# Altium project LED_Panel.PrjPCB (part 1 of 2)
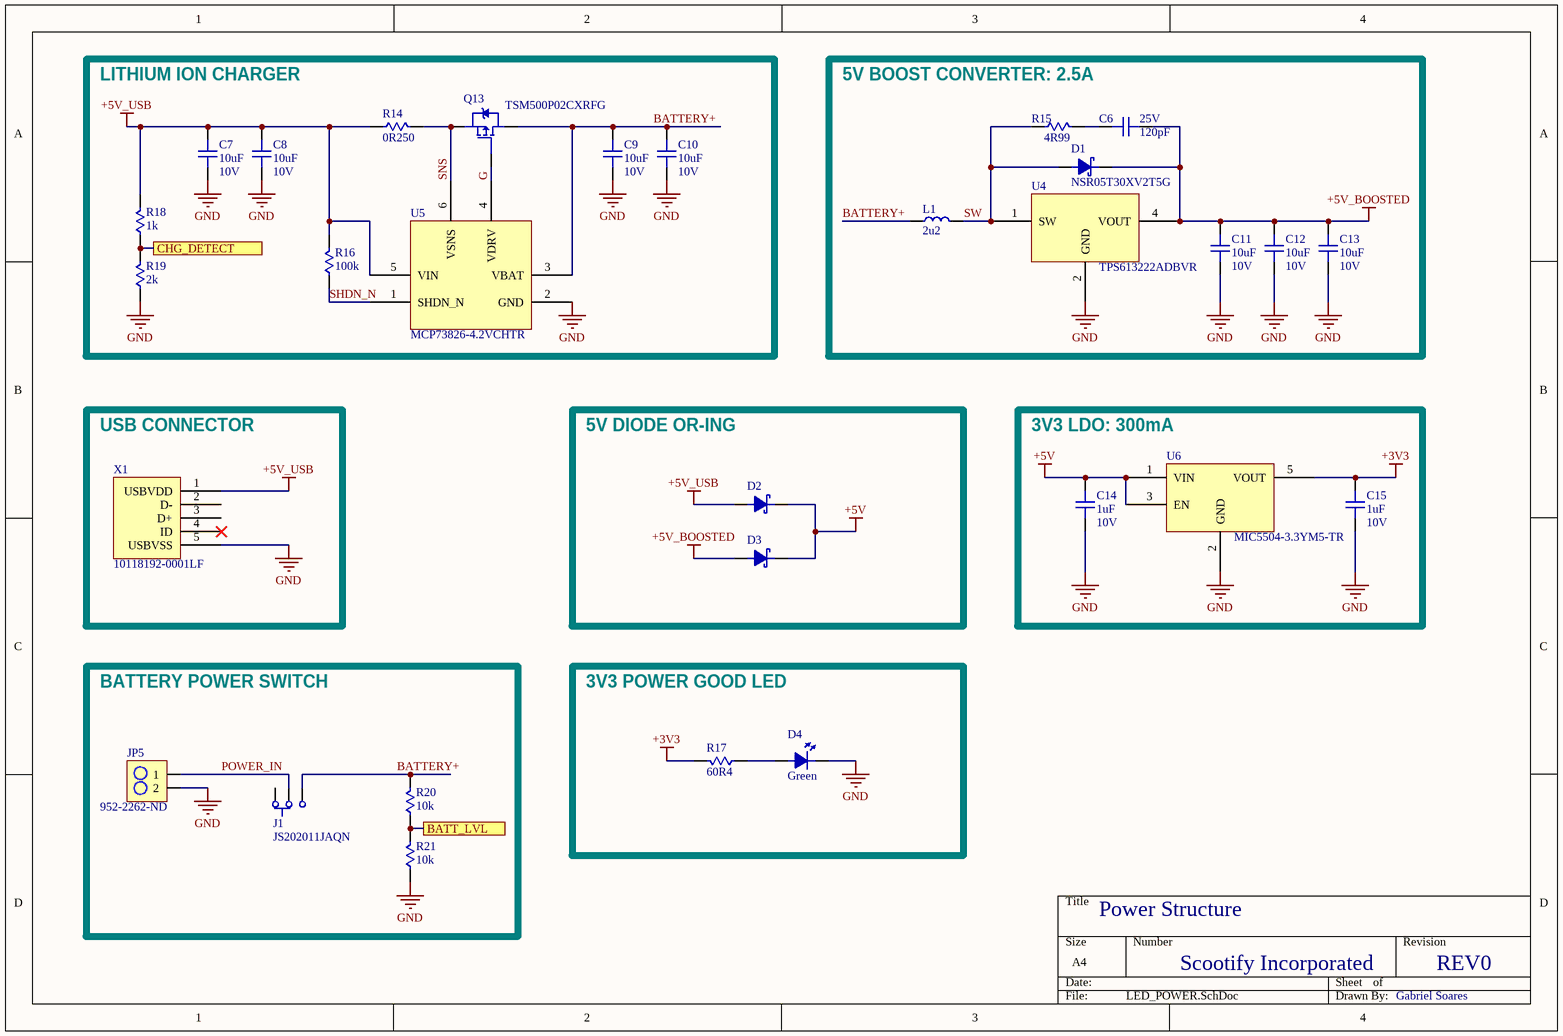
[diagram p0: LED_POWER.SchDoc]
3 sheets, 164 parts. Net scope: flat (ports and power ports of the same name join across sheets).
Board file: LED_BOARD.PcbDoc
Sheets:
  LED_POWER.SchDoc
  LED_MCU.SchDoc
  LEDs.SchDoc

## Sheet LED_POWER.SchDoc: Power Structure
size A4; CompanyName: Scootify Incorporated; DrawnBy: Gabriel Soares; Revision: REV0

### Parts
C6  120pF  Voltage Rating: 25V  [C0402]
C7  10uF  Voltage Rating (DC): 10V  [C0603]
C8  10uF  Voltage Rating (DC): 10V  [C0603]
C9  10uF  Voltage Rating (DC): 10V  [C0603]
C10  10uF  Voltage Rating (DC): 10V  [C0603]
C11  10uF  Voltage Rating (DC): 10V  [C0603]
C12  10uF  Voltage Rating (DC): 10V  [C0603]
C13  10uF  Voltage Rating (DC): 10V  [C0603]
C14  1uF  Voltage Rating: 10V  [C0402]
C15  1uF  Voltage Rating: 10V  [C0402]
D1  NSR05T30XV2T5G  [SOD-523]
D2  RB511SM-30FHT2R  [SOD-523]  (value not drawn)
D3  RB511SM-30FHT2R  [SOD-523]  (value not drawn)
D4  Green  [LED_0603]
J1  JS202011JAQN  [SWITCH]
JP5  952-2262-ND  [2PIN_HEADER]
L1  2u2  [INDUCTOR]
Q13  TSM500P02CXRFG  [SOT23-3_PMOS]
R14  0R250  [R1206]
R15  4R99  [R0402]
R16  100k  [R0402]
R17  60R4  [R0402]
R18  1k  [R0402]
R19  2k  [R0402]
R20  10k  [R0402]
R21  10k  [R0402]
U4  TPS613222ADBVR  [SOT23-5_TPS61233]
U5  MCP73826-4.2VCHTR  [SOT23-6_MCP73826]
U6  MIC5504-3.3YM5-TR  [SOT23-5_MIC5504]
X1  10118192-0001LF  [USB_MICRO]

### Blocks framed on the sheet
LITHIUM ION CHARGER: C7-C10 Q13 R14 R16 R18 R19 U5
5V BOOST CONVERTER: 2.5A: C6 C11-C13 D1 L1 R15 U4
USB CONNECTOR: X1
5V DIODE OR-ING: D2 D3
3V3 LDO: 300mA: C14 C15 U6
BATTERY POWER SWITCH: J1 JP5 R20 R21
3V3 POWER GOOD LED: D4 R17

### Ports
BATT_LVL, CHG_DETECT

### Nets
+3V3: C15.2 R17.2 U6.5(VOUT)
+5V: C14.2 D2.2 D3.2 U6.1(VIN) U6.3(EN)
+5V_BOOSTED: C6.2 C11.2 C12.2 C13.2 D1.2 D3.1 U4.4(VOUT)
+5V_USB: C7.2 C8.2 D2.1 R14.1 R16.2 R18.2 U5.5(VIN) X1.1(USBVDD)
GND: C7.1 C8.1 C9.1 C10.1 C11.1 C12.1 C13.1 C14.1 C15.1 D4.2 JP5.2 R19.1 R21.1 U4.2(GND) U5.2(GND) U6.2(GND) X1.5(USBVSS)
BATT_LVL: R20.1 R21.2 ; port BATT_LVL
BATTERY+: C9.2 C10.2 J1.3 L1.1 Q13.3 R20.2 U5.3(VBAT)
CHG_DETECT: R18.1 R19.2 ; port CHG_DETECT
G: Q13.1 U5.4(VDRV)
POWER_IN: J1.2 JP5.1
SHDN_N: R16.1 U5.1(SHDN_N)
SNS: Q13.2 R14.2 U5.6(VSNS)
SW: D1.1 L1.2 R15.1 U4.1(SW)
NetC6_1: C6.1 R15.2
NetD4_1: D4.1 R17.1

Not connected (* = marked no-connect by the designer): J1 1; X1 2(D-) 3(D+) 4(ID)*

### Library data of the parts
C6 = C0402C121J3GAC7867: CAP MLCC 120pF 25V 0402; Manufacturer: KEMET; Tolerance: 5%; Supplier 1: Digi-Key; Manufacturer Part Number: C0402C121J3GAC7867; Stock 1: 30252; Pricing 1: 1=0.1, 10=0.039, 100=0.0175, 500=0.0125, 1000=0.0098, 2500=0.0089, 5000=0.0082 (USD); Mount: Surface Mount; Case/Package: 0402; Case Code (Imperial): 0402; Case Code (Metric): 1005; Min Operating Temperature: -55°C; Max Operating Temperature: 125°C; Packaging: Tape and Reel; Capacitance: 120pF; Supplier Part Number 1: 399-14880-1-ND
C7-C13 = GRM188R61A106KE69J: CAP MLCC 10uF 10V 0603; Manufacturer: Murata; Dielectric: X5R; Tolerance: 10%; Supplier 1: Digi-Key; Manufacturer Part Number: GRM188R61A106KE69J; Stock 1: 202850; Pricing 1: 1=0.21, 10=0.141, 100=0.0713, 500=0.0488, 1000=0.0431, 2500=0.0413, 5000=0.0375 (USD); Capacitance: 10uF; Length: 1.6mm; Width: 800um; Thickness: 800um; Supplier Part Number 1: 490-14372-1-ND
C14 C15 = CL05A105MP5NNNC: CAP MLCC 1uF 10V 0402; Manufacturer: Samsung; Tolerance: 20%; Dielectric: X5R; Supplier 1: Digi-Key; Manufacturer Part Number: CL05A105MP5NNNC; Stock 1: 3892098; Pricing 1: 1=0.1, 10=0.038, 100=0.0169, 500=0.0121, 1000=0.0095, 2500=0.0086, 5000=0.008 (USD); Mount: Surface Mount; Case/Package: 0402; Case Code (Metric): 1005; Case Code (Imperial): 0402; Min Operating Temperature: -55°C; Max Operating Temperature: 85°C; Package Quantity: 1; Packaging: Tape and Reel; Capacitance: 1uF; Voltage Rating (DC): 10V; Length: 1mm; Height: 0.5mm; Width: 0.02inch; Thickness: 0.022inch; Depth: 0.5mm; Radiation Hardening: No; Lead Free: Lead Free; ComponentLink1URL: http://www.samsungsem.com/kr/support/product-search/mlcc/CL05A105MP5NNNC.jsp?src-supplier=Digi-Key; ComponentLink1Description: http://www.samsungsem.com/kr/support/product-search/mlcc/CL05A105MP5NNNC.jsp?src-supplier=Digi-Key; Supplier Part Number 1: 1276-1448-1-ND
D1 = NSR05T30XV2T5G: DIODE SCHOTTKY 30V 500MA SOD523; Manufacturer: ON Semiconductor; Reverse Recovery Time: 23ns; Supplier 1: Digi-Key; Manufacturer Part Number: NSR05T30XV2T5G; Stock 1: 10419; Pricing 1: 1=0.32, 10=0.266, 100=0.1409, 500=0.0927, 1000=0.063 (USD); Mount: Surface Mount; Packaging: Cut Tape; Max Reverse Voltage (DC): 30V; Average Rectified Current: 500mA; Supplier Part Number 1: NSR05T30XV2T5GOSCT-ND
D2 D3 = RB511SM-30FHT2R: DIODE SCHOTTKY 370mV Forward Voltage @ 10mA, 30V Reverse Voltage RB511SM-30FHT2R             Schottky Rectifier, 30 V, 100 mA, Single, SOD-523, 2 Pins, 370 mV                          New; Manufacturer: Rohm; Forward Current: 100mA; Max Forward Surge Current (Ifsm): 500mA; Supplier 1: Digi-Key; Manufacturer Part Number: RB511SM-30FHT2R; Stock 1: 6514; Pricing 1: 1=0.17, 10=0.16, 100=0.0869, 500=0.0535, 1000=0.0365, 2500=0.031 (USD); Number of Pins: 2; Max Operating Temperature: 125°C; Max Repetitive Reverse Voltage (Vrrm): 30V; Forward Voltage: 370mV; Packaging: Cut Tape; Element Configuration: Single; REACH SVHC: No SVHC; Supplier Part Number 1: RB511SM-30FHT2RCT-ND
D4 = IN-S63AT5G: LED GREEN CLEAR 0603 SMD; Manufacturer: Inolux; Lens Style: Flat; Luminous Intensity: 350mcd; Forward Voltage: 3V; Test Current: 5mA; Viewing Angle: 120°; Dominant Wavelength: 525nm; Lens Size: 0.8mm; Supplier 1: Digi-Key; Manufacturer Part Number: IN-S63AT5G; Stock 1: 2843; Pricing 1: 1=0.55, 10=0.393, 25=0.3012, 100=0.1966, 250=0.1442, 500=0.1223, 1000=0.1005 (USD); Mount: Surface Mount; Case/Package: 0603; Color: Green; Lens Color: Clear; Case Code (Imperial): 0603; Case Code (Metric): 1608; Packaging: Tape and Reel; Lens Transparency: Clear; Length: 1.6mm; Height: 0.39mm; Width: 0.8mm; Supplier Part Number 1: 1830-1062-1-ND
J1 = JS202011JAQN: SWITCH SLIDE DPDT 300MA 6V; Manufacturer: ITT C&K; Actuator Material: Nylon,Polyamide; Switch Function: On-On; Actuator Type: Standard; Switch Travel: 2mm; Electrical Life: 5000Cycles; Supplier 1: Digi-Key; Manufacturer Part Number: JS202011JAQN; Stock 1: 3321; Pricing 1: 1=0.51, 10=0.488, 25=0.4776, 50=0.4268, 100=0.4066, 250=0.3964, 500=0.3354 (USD); Mount: Surface Mount; Contact Material: Copper Alloy; Contact Plating: Silver; Min Operating Temperature: -40°C; Max Operating Temperature: 85°C; Throw Configuration: DPDT; Packaging: Cut Tape; Current Rating: 300mA; Voltage Rating (DC): 6V; Actuator Length: 2mm; Supplier Part Number 1: CKN10722CT-ND
JP5 = M20-9990246: CONN_HeaderPins2pos Headers & Wire Housings 02 SIL VERTICAL PIN HEADER TIN; Manufacturer: Harwin; Contact Resistance: 30mR; Max Current Rating: 3A; Number of Positions: 2; Gender: Male; Connector Type: Male Pin; Insulation Resistance: 10GR; Voltage Rating (AC): 750V; Pitch: 2.54mm; Supplier 1: Digi-Key; Manufacturer Part Number: M20-9990246; Stock 1: 53577; Pricing 1: 1=0.11, 10=0.099, 100=0.0609, 500=0.0504, 1000=0.0441, 5000=0.0378, 10000=0.0368 (USD); Case/Package: SIL; Colour: Black; Housing Colour: Black; Housing Material: Nylon; Contact Plating: Tin; Contact Material: Bronze,Brass; Min Operating Temperature: -40°C; Max Operating Temperature: 105°C; Package Quantity: 1000; Packaging: Bulk; Termination: Solder; Number of Rows: 1; Number of Contacts: 2; Orientation: Straight; Current Rating: 3A; Length: 5.08mm; Depth: 2.54mm; Contact Mating Length: 0.24inch; Radiation Hardening: No; REACH SVHC: No SVHC; ComponentLink1URL: https://datasheet.ciiva.com/8046/315376-8046930.pdf; ComponentLink1Description: https://datasheet.ciiva.com/8046/315376-8046930.pdf; ComponentLink2URL: https://datasheet.ciiva.com/6833/m20-999-6833368.pdf; ComponentLink2Description: https://datasheet.ciiva.com/6833/m20-999-6833368.pdf; ComponentLink3URL: https://datasheet.ciiva.com/11745/0900766b81034e61-11745755.pdf; ComponentLink3Description: https://datasheet.ciiva.com/11745/0900766b81034e61-11745755.pdf; ComponentLink4URL: https://datasheet.ciiva.com/22660/1830818-22660571.pdf; ComponentLink4Description: https://datasheet.ciiva.com/22660/1830818-22660571.pdf; ComponentLink5URL: https://datasheet.ciiva.com/26852/getdatasheetpartid-384170-26852203.pdf; ComponentLink5Description: https://datasheet.ciiva.com/26852/getdatasheetpartid-384170-26852203.pdf; Supplier Part Number 1: 952-2262-ND
L1 = CIGT252008LM2R2MNE (2): IND 2.2uH 2.1A Saturation Current; Manufacturer: Samsung; Core Material: Metal,Composite; Tolerance: 20%; Current Rating: 2A; Shielding: Unshielded; DC Resistance (DCR): 97mR; Test Frequency: 1MHz; Supplier 1: Digi-Key; Manufacturer Part Number: CIGT252008LM2R2MNE; Stock 1: 8715; Pricing 1: 1=0.22, 10=0.197, 100=0.1314, 500=0.1095, 1000=0.092 (USD); Mount: Surface Mount; Case/Package: 1008; Case Code (Imperial): 1008; Case Code (Metric): 2520; Min Operating Temperature: -40°C; Max Operating Temperature: 125°C; Composition: Thin Film; Packaging: Cut Tape; Inductance: 2.2uH; Saturation Current: 2.1A; Supplier Part Number 1: 1276-6925-1-ND
Q13 = TSM500P02CXRFG: MOSFET P-CH 20V 4.7A 1.56W Rds(ON)=50mOhm; Manufacturer: Taiwan Semiconductor; Rds On Max: 50mR; Input Capacitance: 850pF; Supplier 1: Digi-Key; Manufacturer Part Number: TSM500P02CXRFG; Stock 1: 9267; Pricing 1: 1=0.39, 10=0.309, 100=0.2123, 500=0.1456, 1000=0.1092 (USD); Mount: Surface Mount; Case/Package: SOT-23; Packaging: Tape and Reel; Drain to Source Voltage (Vdss): 20V; Continuous Drain Current (ID): 4.7A; Max Power Dissipation: 1.56W; Supplier Part Number 1: TSM500P02CXRFGCT-ND
R14 = PT1206FR-7W0R25L: RES SMD 250mOhm 0.5W 1206; Manufacturer: Yageo; Resistance: 250mR; Tolerance: 1%; Max Power Dissipation: 500mW; Temperature Coefficient: 75ppm/°C; Supplier 1: Digi-Key; Manufacturer Part Number: PT1206FR-7W0R25L; Stock 1: 13947; Pricing 1: 1=0.47, 10=0.364, 25=0.2768, 50=0.2056, 100=0.1528, 250=0.1291, 500=0.1107, 1000=0.0843 (USD); Case/Package: 1206; Min Operating Temperature: -55°C; Max Operating Temperature: 155°C; Packaging: Tape and Reel; Composition: Thick Film; Number of Terminations: 2; Features: Moisture Resistant,Automotive AEC-Q200; Length: 0.122inch; Height: 0.026inch; Width: 0.063inch; Supplier Part Number 1: YAG5802CT-ND
R15 = RMCF0402FT4R99: RES SMD 4.99 OHM 0402; Manufacturer: Stackpole Electronics; Resistance: 4.99R; Tolerance: 1%; Max Power Dissipation: 63mW; Temperature Coefficient: 200ppm/°C; Supplier 1: Digi-Key; Manufacturer Part Number: RMCF0402FT4R99; Stock 1: 144934; Pricing 1: 1=0.1, 10=0.02, 100=0.0082, 1000=0.0037, 2500=0.0032, 5000=0.0026 (USD); Mount: Surface Mount; Case/Package: 0402; Case Code (Metric): 1005; Case Code (Imperial): 0402; Contact Plating: Tin,Matte; Min Operating Temperature: -55°C; Max Operating Temperature: 155°C; Packaging: Tape and Reel; Package Quantity: 1; Composition: Thick Film; Number of Terminations: 2; Features: Automotive AEC-Q200; Length: 0.039inch; Height: 0.016inch; Width: 0.02inch; Lead Free: Contains Lead; Supplier Part Number 1: RMCF0402FT4R99CT-ND
R16 = RMCF0402FT100K: RES SMD 100K 0402; Manufacturer: Stackpole Electronics; Tolerance: 1%; Resistance: 100kR; Power Rating: 62.5mW; Temperature Coefficient: 100ppm/°C; Max Power Dissipation: 63mW; Supplier 1: Digi-Key; Manufacturer Part Number: RMCF0402FT100K; Stock 1: 796221; Pricing 1: 1=0.1, 10=0.015, 100=0.0061, 1000=0.0028, 2500=0.0024, 5000=0.002 (USD); Mount: Surface Mount; Case/Package: 0402; Case Code (Metric): 1005; Case Code (Imperial): 0402; Contact Plating: Tin,Matte; Min Operating Temperature: -55°C; Max Operating Temperature: 155°C; Packaging: Tape and Reel; Composition: Thick Film; Number of Terminations: 2; Military Standard: Not; Features: Automotive AEC-Q200; Length: 1mm; Height: 0.016inch; Width: 0.02inch; Depth: 0.5mm; Radiation Hardening: No; Lead Free: Lead Free; ComponentLink1URL: https://www.verical.com/server-webapp/html/getDatasheet?partID=482656&src-supplier=Verical; ComponentLink1Description: https://www.verical.com/server-webapp/html/getDatasheet?partID=482656&src-supplier=Verical; Supplier Part Number 1: RMCF0402FT100KCT-ND
R17 = RMCF0402FT60R4: RES SMD 60.4 OHM 1% 1/16W 0402; Manufacturer: Stackpole Electronics; Resistance: 60.4R; Max Power Dissipation: 63mW; Temperature Coefficient: 100ppm/°C; Supplier 1: Digi-Key; Manufacturer Part Number: RMCF0402FT60R4; Stock 1: 28531; Pricing 1: 1=0.1, 10=0.015, 100=0.0061, 1000=0.0028, 2500=0.0024, 5000=0.002 (USD); Mount: Surface Mount; Case/Package: 0402; Case Code (Metric): 1005; Case Code (Imperial): 0402; Contact Plating: Tin,Matte; Min Operating Temperature: -55°C; Max Operating Temperature: 155°C; Packaging: Tape and Reel; Tolerance: 1%; Composition: Thick Film; Number of Terminations: 2; Features: Automotive AEC-Q200; Length: 0.039inch; Height: 0.016inch; Width: 0.02inch; Radiation Hardening: No; Lead Free: Lead Free; Supplier Part Number 1: RMCF0402FT60R4CT-ND
R18 = RR0510P-102-D: RES SMD 1K OHM 0.5% 1/16W 0402; Manufacturer: Susumu; Resistance: 1kR; Power Rating: 63mW; Voltage Rating: 25V; Temperature Coefficient: 25ppm/°C; Supplier 1: Digi-Key; Manufacturer Part Number: RR0510P-102-D; Stock 1: 721157; Pricing 1: 1=0.1, 10=0.074, 100=0.0285, 1000=0.0125, 2500=0.0108, 5000=0.0097 (USD); Case/Package: 0402; Number of Pins: 2; Case Code (Metric): 1005; Case Code (Imperial): 0402; Min Operating Temperature: -55°C; Max Operating Temperature: 125°C; Package Quantity: 1; Tolerance: 0.5%; Packaging: Tape and Reel; Composition: Thin Film; Number of Terminations: 2; Termination: SMD/SMT; Max Power Dissipation: 63mW; Voltage Rating (DC): 25V; Length: 0.039inch; Height: 0.016inch; Width: 0.02inch; REACH SVHC: Unknown; Lead Free: Lead Free; ComponentLink1URL: http://www.susumu.co.jp/common/pdf/n_catalog_partition05_en.pdf; ComponentLink1Description: http://www.susumu.co.jp/common/pdf/n_catalog_partition05_en.pdf; ComponentLink2URL: http://www.farnell.com/datasheets/1581132.pdf; ComponentLink2Description: http://www.farnell.com/datasheets/1581132.pdf; Supplier Part Number 1: RR05P1.0KDCT-ND
R19 = RC0402FR-072KL: RES SMD 2K OHM 1% 1/16W 0402; Manufacturer: Yageo; Resistance: 2kR; Power Rating: 63mW; Voltage Rating: 50V; Temperature Coefficient: 100ppm/°C; Supplier 1: Digi-Key; Manufacturer Part Number: RC0402FR-072KL; Stock 1: 12787794; Pricing 1: 1=0.1, 10=0.016, 100=0.0067, 1000=0.003, 2500=0.0026, 5000=0.0022 (USD); Case/Package: 0402; Case Code (Metric): 1005; Case Code (Imperial): 0402; Min Operating Temperature: -55°C; Max Operating Temperature: 155°C; Tolerance: 1%; Package Quantity: 1; Packaging: Tape and Reel; Composition: Thick Film; Number of Terminations: 2; Termination: SMD/SMT; Military Standard: Not; Max Power Dissipation: 63mW; Voltage Rating (DC): 50V; Working Voltage: 50V; Features: Moisture Resistant; Length: 1mm; Height: 0.016inch; Width: 0.02inch; Depth: 0.5mm; REACH SVHC: Unknown; Lead Free: Lead Free; ComponentLink1URL: http://www.yageo.com/documents/recent/PYu-RC_Group_51_RoHS_L_10.pdf?src-supplier=Digi-Key; ComponentLink1Description: http://www.yageo.com/documents/recent/PYu-RC_Group_51_RoHS_L_10.pdf?src-supplier=Digi-Key; ComponentLink2URL: http://documents.rs-components.com/techlib://itc_doclist_GB.htm?stockno=6186510&src-supplier=RSComponents; ComponentLink2Description: http://documents.rs-components.com/techlib://itc_doclist_GB.htm?stockno=6186510&src-supplier=RSComponents; ComponentLink3URL: https://www.verical.com/server-webapp/html/getDatasheet?partID=358921&src-supplier=Verical; ComponentLink3Description: https://www.verical.com/server-webapp/html/getDatasheet?partID=358921&src-supplier=Verical; ComponentLink4URL: http://www.mouser.com/ds/2/447/PYu-RC0402_51_RoHS_L_6_r-8721.pdf?src-supplier=Mouser; ComponentLink4Description: http://www.mouser.com/ds/2/447/PYu-RC0402_51_RoHS_L_6_r-8721.pdf?src-supplier=Mouser; ComponentLink5URL: http://www.farnell.com/datasheets/1018594.pdf?src-supplier=Element14; ComponentLink5Description: http://www.farnell.com/datasheets/1018594.pdf?src-supplier=Element14; ComponentLink6URL: http://www.farnell.com/datasheets/2167052.pdf?src-supplier=Element14; ComponentLink6Description: http://www.farnell.com/datasheets/2167052.pdf?src-supplier=Element14; Supplier Part Number 1: 311-2KLRCT-ND
R20 R21 = RC0402JR-0710KL: RES SMD 10K OHM 5% 1/16W 0402; Manufacturer: Yageo; Resistance: 10kR; Power Rating: 62.5mW; Voltage Rating: 50V; Temperature Coefficient: 100ppm/°C; Max Power Dissipation: 63mW; Supplier 1: Digi-Key; Manufacturer Part Number: RC0402JR-0710KL; Stock 1: 47303622; Pricing 1: 1=0.1, 10=0.018, 100=0.0073, 1000=0.0033, 2500=0.0029, 5000=0.0024 (USD); Case/Package: 0402; Case Code (Metric): 1005; Case Code (Imperial): 0402; Min Operating Temperature: -55°C; Max Operating Temperature: 155°C; Packaging: Tape and Reel; Tolerance: 5%; Package Quantity: 1; Composition: Thick Film; Number of Terminations: 2; Termination: SMD/SMT; Military Standard: Not; Features: Moisture Resistant; Length: 1mm; Height: 0.016inch; Width: 0.02inch; Depth: 0.5mm; REACH SVHC: Unknown; Lead Free: Lead Free; Supplier Part Number 1: 311-10KJRCT-ND
U4 = TPS613222ADBVR: IC DCDC BOOST CONVERTER 5V OUTPUT 2.5A; Manufacturer: Texas Instruments; Output Type: Fixed; Output Configuration: Positive; Number of Outputs: 1; Min Input Voltage: 900mV; Max Input Voltage: 5.5V; Switching Frequency: 2MHz; Synchronous Rectifier: Yes; Supplier 1: Digi-Key; Manufacturer Part Number: TPS613222ADBVR; Stock 1: 2444; Pricing 1: 1=0.84, 10=0.747, 100=0.5828, 500=0.4814, 1000=0.3801 (USD); Mount: Surface Mount; Case/Package: SOT-23-5; Min Operating Temperature: -40°C; Max Operating Temperature: 85°C; Topology: Boost; Packaging: Tape and Reel; Min Output Voltage: 5V; Output Current: 2.5A; ComponentLink1URL: http://www.ti.com/lit/gpn/tps61322?src-supplier=Digi-Key; ComponentLink1Description: http://www.ti.com/lit/gpn/tps61322?src-supplier=Digi-Key; Supplier Part Number 1: 296-50503-1-ND
U5 = MCP73826-4.2VCHTR: IC BATT CHARGER LI-ION 4.2V CCCV WITH 43% CURRENT DEPLETION MODE; Manufacturer: Microchip; Min Supply Voltage: 4.5V; Max Supply Voltage: 5.5V; Number of Cells: 1; Output Current: 75mA; Operating Supply Current: 260uA; Max Output Voltage: 4.24V; Min Output Voltage: 4.158V; Nominal Supply Current: 560mA; Supplier 1: Digi-Key; Manufacturer Part Number: MCP73826-4.2VCHTR; Stock 1: 379; Pricing 1: 1=0.93, 25=0.7724, 100=0.7004 (USD); Mount: Surface Mount; Case/Package: SOT-23; Number of Pins: 6; Min Operating Temperature: -20°C; Max Operating Temperature: 85°C; Package Quantity: 1; Packaging: Tape and Reel; Output Voltage: 4.2V; Length: 3mm; Height: 1.3mm; Width: 1.75mm; Radiation Hardening: No; REACH SVHC: No SVHC; Lead Free: Lead Free; ComponentLink1URL: http://www.microchip.com/mymicrochip/filehandler.aspx?ddocname=en026002&src-supplier=Digi-Key; ComponentLink1Description: http://www.microchip.com/mymicrochip/filehandler.aspx?ddocname=en026002&src-supplier=Digi-Key; ComponentLink2URL: http://www.microchip.com/mymicrochip/filehandler.aspx?ddocname=en023833&src-supplier=Digi-Key; ComponentLink2Description: http://www.microchip.com/mymicrochip/filehandler.aspx?ddocname=en023833&src-supplier=Digi-Key; ComponentLink3URL: http://www.farnell.com/datasheets/1789214.pdf?src-supplier=Farnell; ComponentLink3Description: http://www.farnell.com/datasheets/1789214.pdf?src-supplier=Farnell; ComponentLink4URL: http://www.farnell.com/datasheets/1789214.pdf?src-supplier=Element14; ComponentLink4Description: http://www.farnell.com/datasheets/1789214.pdf?src-supplier=Element14; ComponentLink5URL: http://www.mouser.com/ds/2/268/21705a-63878.pdf?src-supplier=Mouser; ComponentLink5Description: http://www.mouser.com/ds/2/268/21705a-63878.pdf?src-supplier=Mouser; ComponentLink6URL: http://ww1.microchip.com/downloads/jp/DeviceDoc/21705a.pdf?src-supplier=Avnet+Europe; ComponentLink6Description: http://ww1.microchip.com/downloads/jp/DeviceDoc/21705a.pdf?src-supplier=Avnet+Europe; ComponentLink7URL: http://uk.rs-online.com/webdocs/0806/0900766b808065c8.pdf?src-supplier=RSComponents; ComponentLink7Description: http://uk.rs-online.com/webdocs/0806/0900766b808065c8.pdf?src-supplier=RSComponents; Supplier Part Number 1: MCP73826-4.2VCHCT-ND
U6 = MIC5504-3.3YM5-TR: IC LDO 3V3 300mA 5V INPUT; Manufacturer: Microchip Micrel; Min Input Voltage: 2.5V; Max Input Voltage: 5.5V; Nominal Output Voltage: 3.3V; Dropout Voltage: 380mV; Output Type: Fixed; Number of Outputs: 1; Quiescent Current: 38uA; Accuracy: 3%; Operating Supply Current: 42uA; Power Supply Rejection Ratio (PSRR): 60dB; Supplier 1: Digi-Key; Manufacturer Part Number: MIC5504-3.3YM5-TR; Stock 1: 30791; Pricing 1: 1=0.11, 25=0.0928, 100=0.0824 (USD); Mount: Surface Mount; Case/Package: SOT-23-5; Number of Pins: 5; Min Operating Temperature: -40°C; Max Operating Temperature: 125°C; Output Current: 300mA; Packaging: Tape and Reel; Output Voltage: 3.3V; Max Output Current: 300mA; Length: 2.9mm; Height: 1.1mm; Width: 1.6mm; REACH SVHC: No SVHC; ComponentLink1URL: http://www.farnell.com/datasheets/1856860.pdf?src-supplier=Element14; ComponentLink1Description: http://www.farnell.com/datasheets/1856860.pdf?src-supplier=Element14; Supplier Part Number 1: 576-4764-1-ND
X1 = 10118192-0001LF: CONN_USB - micro B USB 2.0 Receptacle Connector 5 Position Surface Mount, Right Angle, Horizontal; Manufacturer: Amphenol FCI; Current Rating: 1.8A; Connector Type: USB,Receptacle; Number of Contacts: 5; Insulation Resistance: 1GR; Number of Ports: 1; Max Voltage Rating (AC): 100V; USB Standard: USB 2.0; Pitch: 0.65mm; Supplier 1: Digi-Key; Manufacturer Part Number: 10118192-0001LF; Stock 1: 197826; Pricing 1: 1=0.46, 10=0.437, 25=0.3744, 50=0.318, 100=0.3056, 250=0.2744, 500=0.262 (USD); Mount: Surface Mount,Horizontal; Contact Material: Copper Alloy; Contact Plating: Nickel,Gold; Number of Terminals: 5; Housing Material: Polymer; Colour: Black; Min Operating Temperature: -55°C; Max Operating Temperature: 85°C; Packaging: Tape and Reel; Package Quantity: 1400; Gender: Receptacle; Termination: Solder; Voltage Rating: 100V; Orientation: Right Angle; Length: 7.86mm; Depth: 5.57mm; Radiation Hardening: No; REACH SVHC: No SVHC; Lead Free: Lead Free; Flammability Rating: UL94 V-0; ComponentLink1URL: https://datasheet.ciiva.com/26853/getdatasheetpartid-418041-26853891.pdf; ComponentLink1Description: https://datasheet.ciiva.com/26853/getdatasheetpartid-418041-26853891.pdf; ComponentLink2URL: https://datasheet.ciiva.com/851/10118192-851112.pdf; ComponentLink2Description: https://datasheet.ciiva.com/851/10118192-851112.pdf; ComponentLink3URL: https://datasheet.ciiva.com/4598/10118192ac-197249-4598796.pdf; ComponentLink3Description: https://datasheet.ciiva.com/4598/10118192ac-197249-4598796.pdf; Supplier Part Number 1: 609-4613-1-ND

## Sheet LED_MCU.SchDoc
size A3
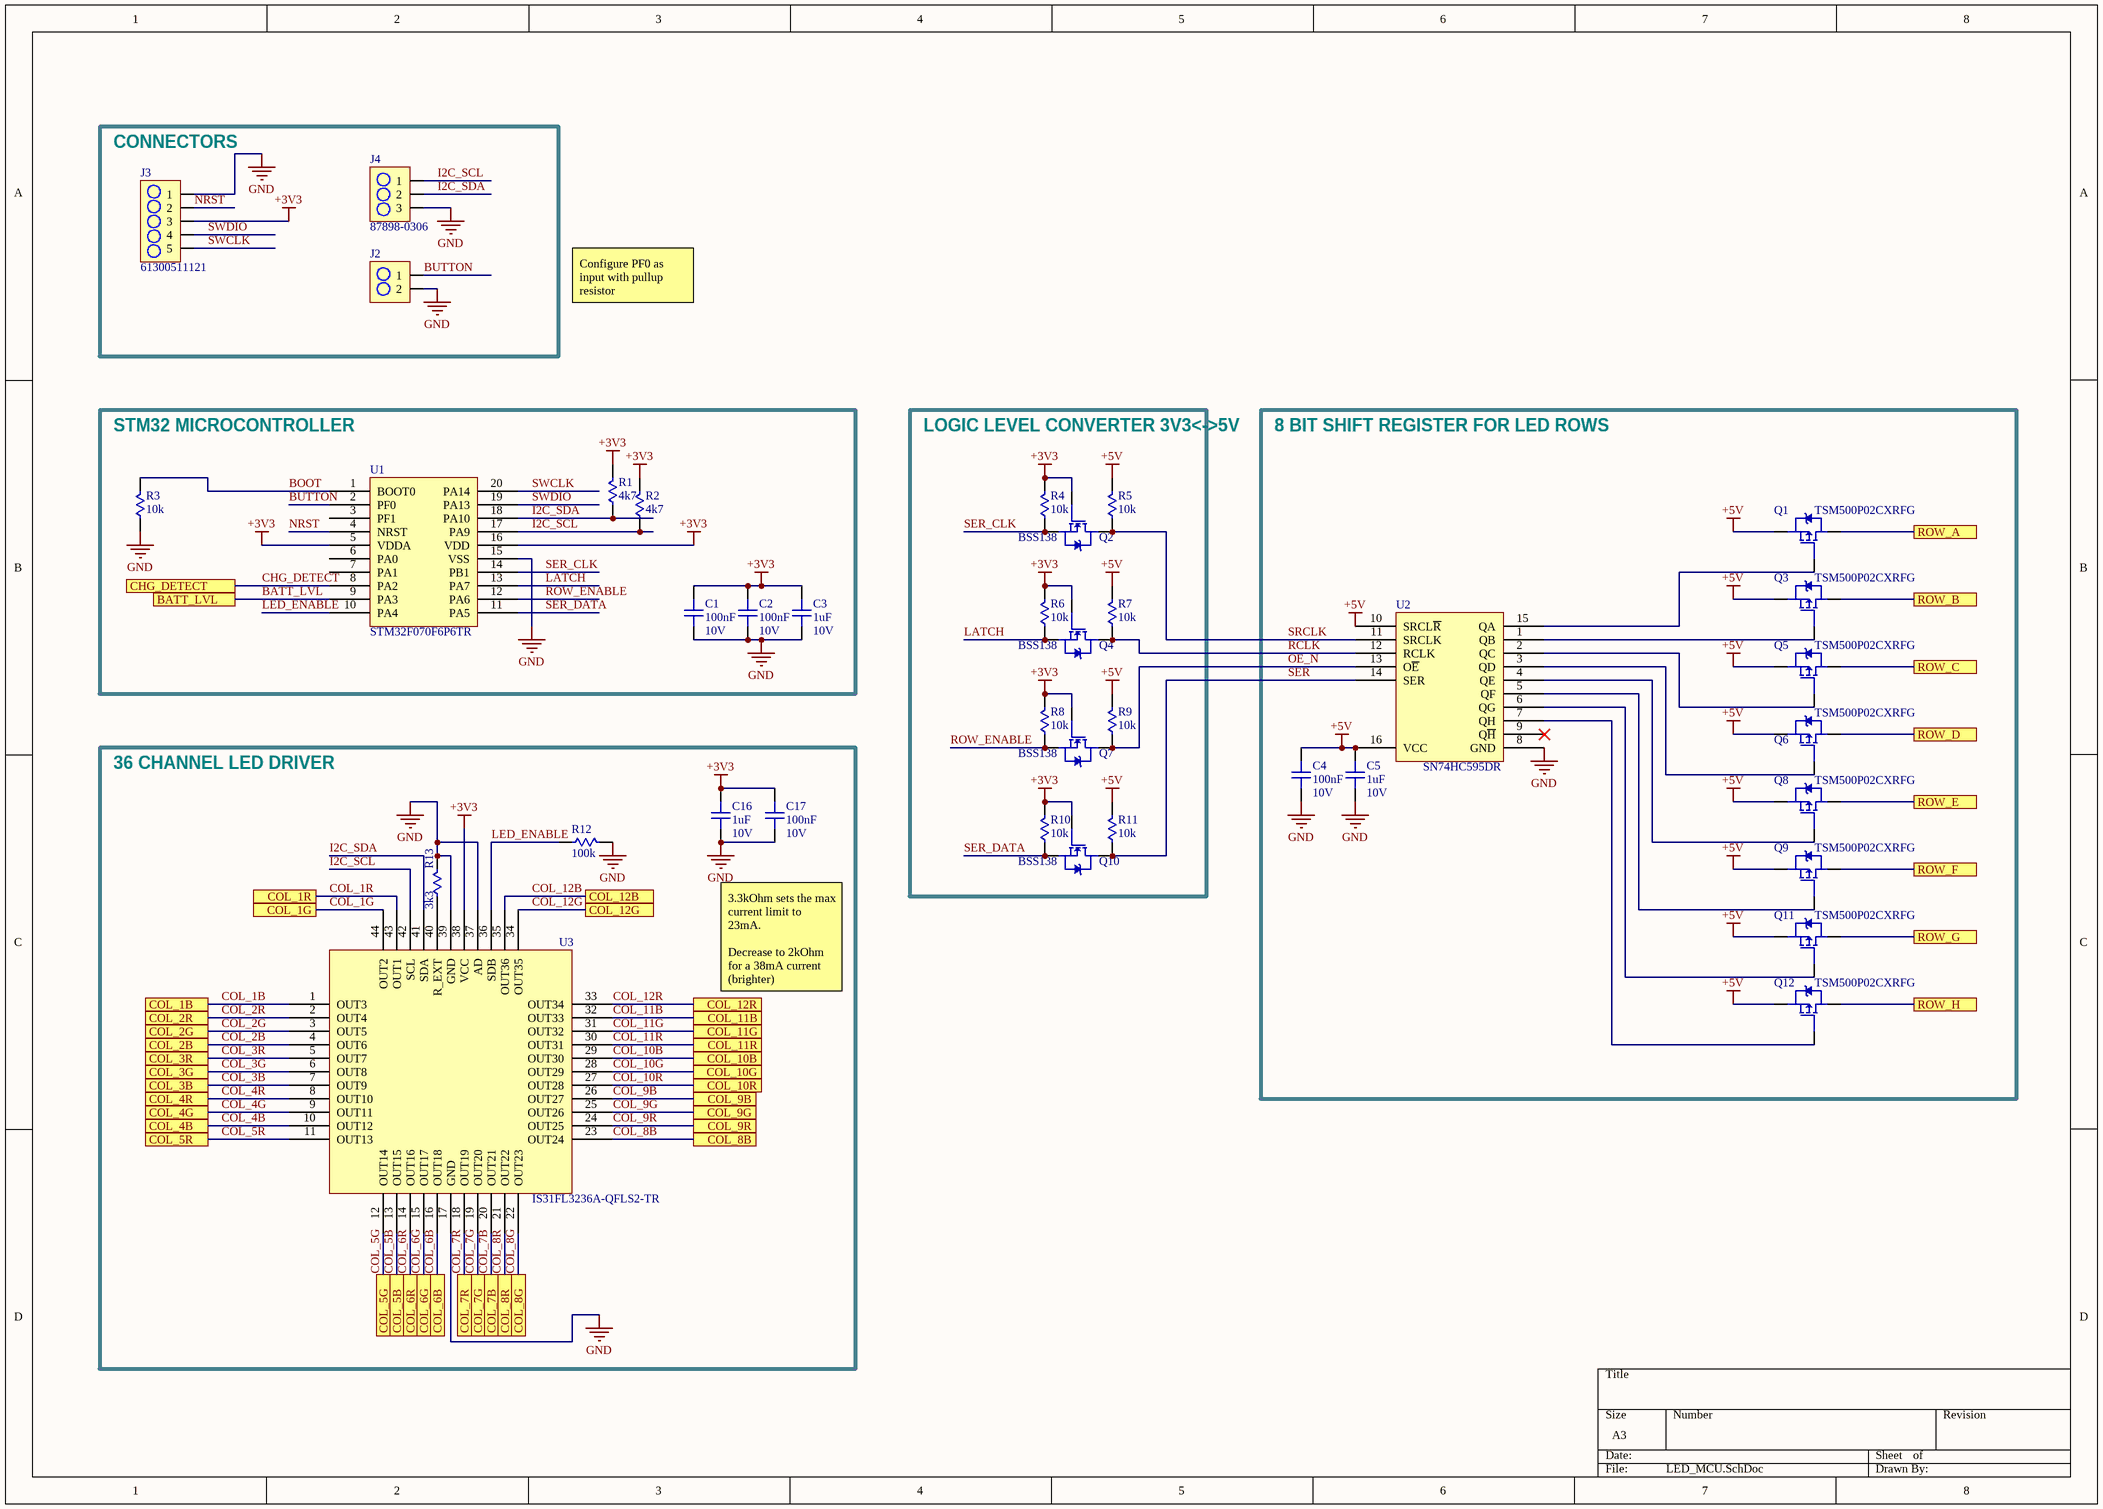
[diagram p1: LED_MCU.SchDoc]

### Parts
C1  100nF  Voltage Rating: 10V  [C0402]
C2  100nF  Voltage Rating: 10V  [C0402]
C3  1uF  Voltage Rating: 10V  [C0402]
C4  100nF  Voltage Rating: 10V  [C0402]
C5  1uF  Voltage Rating: 10V  [C0402]
C16  1uF  Voltage Rating: 10V  [C0402]
C17  100nF  Voltage Rating: 10V  [C0402]
J2  Button Pads  [2PIN_HEADER - BUTTON]  (value not drawn)
J3  61300511121  [5PIN_HEADER]
J4  87898-0306  [3PIN_SMD]
Q1  TSM500P02CXRFG  [SOT23-3_PMOS]
Q2  BSS138  [SOT23-3_PMOS]
Q3  TSM500P02CXRFG  [SOT23-3_PMOS]
Q4  BSS138  [SOT23-3_PMOS]
Q5  TSM500P02CXRFG  [SOT23-3_PMOS]
Q6  TSM500P02CXRFG  [SOT23-3_PMOS]
Q7  BSS138  [SOT23-3_PMOS]
Q8  TSM500P02CXRFG  [SOT23-3_PMOS]
Q9  TSM500P02CXRFG  [SOT23-3_PMOS]
Q10  BSS138  [SOT23-3_PMOS]
Q11  TSM500P02CXRFG  [SOT23-3_PMOS]
Q12  TSM500P02CXRFG  [SOT23-3_PMOS]
R1  4k7  [R0402]
R2  4k7  [R0402]
R3  10k  [R0402]
R4  10k  [R0402]
R5  10k  [R0402]
R6  10k  [R0402]
R7  10k  [R0402]
R8  10k  [R0402]
R9  10k  [R0402]
R10  10k  [R0402]
R11  10k  [R0402]
R12  100k  [R0402]
R13  3k3  [R0402]
U1  STM32F070F6P6TR  [TSSOP-20]
U2  SN74HC595DR  [SOIC-16]
U3  IS31FL3236A-QFLS2-TR  [QFN-44]

### Blocks framed on the sheet
CONNECTORS: J2-J4
STM32 MICROCONTROLLER: C1-C3 R1-R3 U1
LOGIC LEVEL CONVERTER 3V3<->5V: Q2 Q4 Q7 Q10 R4-R11
8 BIT SHIFT REGISTER FOR LED ROWS: C4 C5 Q1 Q3 Q5 Q6 Q8 Q9 Q11 Q12 U2
36 CHANNEL LED DRIVER: C16 C17 R12 R13 U3

### Ports
BATT_LVL, CHG_DETECT, COL_1B, COL_1G, COL_1R, COL_2B, COL_2G, COL_2R, COL_3B, COL_3G, COL_3R, COL_4B, COL_4G, COL_4R, COL_5B, COL_5G, COL_5R, COL_6B, COL_6G, COL_6R, COL_7B, COL_7G, COL_7R, COL_8B, COL_8G, COL_8R, COL_9B, COL_9G, COL_9R, COL_10B, COL_10G, COL_10R, COL_11B, COL_11G, COL_11R, COL_12B, COL_12G, COL_12R, ROW_A, ROW_B, ROW_C, ROW_D, ROW_E, ROW_F, ROW_G, ROW_H

### Nets
+3V3: C1.2 C2.2 C3.2 C16.2 C17.2 J3.3 Q2.1 Q4.1 Q7.1 Q10.1 R1.2 R2.2 R4.2 R6.2 R8.2 R10.2 U1.5(VDDA) U1.16(VDD) U3.38(VCC)
+5V: C4.2 C5.2 Q1.2 Q3.2 Q5.2 Q6.2 Q8.2 Q9.2 Q11.2 Q12.2 R5.2 R7.2 R9.2 R11.2 U2.10(SRCL~{R}) U2.16(VCC)
GND: C1.1 C2.1 C3.1 C4.1 C5.1 C16.1 C17.1 J2.2 J3.1 J4.3 R3.1 R12.2 R13.2 U1.15(VSS) U2.8(GND) U3.17(GND) U3.37(AD) U3.39(GND)
BATT_LVL: U1.9(PA3) ; port BATT_LVL
BOOT: R3.2 U1.1(BOOT0)
BUTTON: J2.1 U1.2(PF0)
CHG_DETECT: U1.8(PA2) ; port CHG_DETECT
COL_1B: U3.1(OUT3) ; port COL_1B
COL_1G: U3.44(OUT2) ; port COL_1G
COL_1R: U3.43(OUT1) ; port COL_1R
COL_2B: U3.4(OUT6) ; port COL_2B
COL_2G: U3.3(OUT5) ; port COL_2G
COL_2R: U3.2(OUT4) ; port COL_2R
COL_3B: U3.7(OUT9) ; port COL_3B
COL_3G: U3.6(OUT8) ; port COL_3G
COL_3R: U3.5(OUT7) ; port COL_3R
COL_4B: U3.10(OUT12) ; port COL_4B
COL_4G: U3.9(OUT11) ; port COL_4G
COL_4R: U3.8(OUT10) ; port COL_4R
COL_5B: U3.13(OUT15) ; port COL_5B
COL_5G: U3.12(OUT14) ; port COL_5G
COL_5R: U3.11(OUT13) ; port COL_5R
COL_6B: U3.16(OUT18) ; port COL_6B
COL_6G: U3.15(OUT17) ; port COL_6G
COL_6R: U3.14(OUT16) ; port COL_6R
COL_7B: U3.20(OUT21) ; port COL_7B
COL_7G: U3.19(OUT20) ; port COL_7G
COL_7R: U3.18(OUT19) ; port COL_7R
COL_8B: U3.23(OUT24) ; port COL_8B
COL_8G: U3.22(OUT23) ; port COL_8G
COL_8R: U3.21(OUT22) ; port COL_8R
COL_9B: U3.26(OUT27) ; port COL_9B
COL_9G: U3.25(OUT26) ; port COL_9G
COL_9R: U3.24(OUT25) ; port COL_9R
COL_10B: U3.29(OUT30) ; port COL_10B
COL_10G: U3.28(OUT29) ; port COL_10G
COL_10R: U3.27(OUT28) ; port COL_10R
COL_11B: U3.32(OUT33) ; port COL_11B
COL_11G: U3.31(OUT32) ; port COL_11G
COL_11R: U3.30(OUT31) ; port COL_11R
COL_12B: U3.35(OUT36) ; port COL_12B
COL_12G: U3.34(OUT35) ; port COL_12G
COL_12R: U3.33(OUT34) ; port COL_12R
I2C_SCL: J4.1 R2.1 U1.17(PA9) U3.42(SCL)
I2C_SDA: J4.2 R1.1 U1.18(PA10) U3.41(SDA)
LATCH: Q4.2 R6.1 U1.13(PA7)
LED_ENABLE: R12.1 U1.10(PA4) U3.36(SDB)
NRST: J3.2 U1.4(NRST)
OE_N: Q7.3 R9.1 U2.13(O~{E})
RCLK: Q4.3 R7.1 U2.12(RCLK)
ROW_A: Q1.3 ; port ROW_A
ROW_B: Q3.3 ; port ROW_B
ROW_C: Q5.3 ; port ROW_C
ROW_D: Q6.3 ; port ROW_D
ROW_E: Q8.3 ; port ROW_E
ROW_ENABLE: Q7.2 R8.1 U1.12(PA6)
ROW_F: Q9.3 ; port ROW_F
ROW_G: Q11.3 ; port ROW_G
ROW_H: Q12.3 ; port ROW_H
SER: Q10.3 R11.1 U2.14(SER)
SER_CLK: Q2.2 R4.1 U1.14(PB1)
SER_DATA: Q10.2 R10.1 U1.11(PA5)
SRCLK: Q2.3 R5.1 U2.11(SRCLK)
SWCLK: J3.5 U1.20(PA14)
SWDIO: J3.4 U1.19(PA13)
NetQ1_1: Q1.1 U2.15(QA)
NetQ3_1: Q3.1 U2.1(QB)
NetQ5_1: Q5.1 U2.2(QC)
NetQ6_1: Q6.1 U2.3(QD)
NetQ8_1: Q8.1 U2.4(QE)
NetQ9_1: Q9.1 U2.5(QF)
NetQ11_1: Q11.1 U2.6(QG)
NetQ12_1: Q12.1 U2.7(QH)
NetR13_1: R13.1 U3.40(R_EXT)

Not connected (* = marked no-connect by the designer): U1 3(PF1) 6(PA0) 7(PA1); U2 9(Q~{H})*

### Notes on the sheet
- Configure PF0 as input with pullup resistor
- 3.3kOhm sets the max current limit to 23mA.
  Decrease to 2kOhm for a 38mA current (brighter)

### Library data of the parts
C1 C2 C4 C17 = CL05A104MP5NNNC: CAP MLCC 0.1uF 10V X5R 0402 20% SMD 0402 85C Paper T/R; Manufacturer: Samsung; Supplier 1: Digi-Key; Manufacturer Part Number: CL05A104MP5NNNC; Stock 1: 100000; Pricing 1: 1=0.1, 10=0.024, 100=0.0106, 500=0.0076, 1000=0.006, 2500=0.0054, 5000=0.005 (USD); Mount: Surface Mount; Case/Package: 0402; Case Code (Metric): 1005; Case Code (Imperial): 0402; Min Operating Temperature: -55°C; Max Operating Temperature: 85°C; Packaging: Tape and Reel; Capacitance: 100nF; Tolerance: 20%; Dielectric: X5R; Voltage Rating (DC): 10V; Length: 1mm; Height: 0.5mm; Width: 0.02inch; Thickness: 0.022inch; Depth: 0.5mm; Radiation Hardening: No; Lead Free: Lead Free; ComponentLink1URL: https://media.digikey.com/pdf/Data%20Sheets/Samsung%20PDFs/CL_Series_MLCC_ds.pdf; ComponentLink1Description: https://media.digikey.com/pdf/Data%20Sheets/Samsung%20PDFs/CL_Series_MLCC_ds.pdf; Supplier Part Number 1: 1276-1443-1-ND
C3 C5 C16 = CL05A105MP5NNNC: as C14 on sheet LED_POWER; Supplier 1: Digi-Key; Manufacturer Part Number: CL05A105MP5NNNC; Stock 1: 3892098; Pricing 1: 1=0.1, 10=0.038, 100=0.0169, 500=0.0121, 1000=0.0095, 2500=0.0086, 5000=0.008 (USD); Mount: Surface Mount; Case/Package: 0402; Case Code (Metric): 1005; Case Code (Imperial): 0402; Min Operating Temperature: -55°C; Max Operating Temperature: 85°C; Package Quantity: 1; Packaging: Tape and Reel; Capacitance: 1uF; Voltage Rating (DC): 10V; Length: 1mm; Height: 0.5mm; Width: 0.02inch; Thickness: 0.022inch; Depth: 0.5mm; Radiation Hardening: No; Lead Free: Lead Free; ComponentLink1URL: http://www.samsungsem.com/kr/support/product-search/mlcc/CL05A105MP5NNNC.jsp?src-supplier=Digi-Key; ComponentLink1Description: http://www.samsungsem.com/kr/support/product-search/mlcc/CL05A105MP5NNNC.jsp?src-supplier=Digi-Key; Supplier Part Number 1: 1276-1448-1-ND
J3 = 61300511121: CONN_HeaderPins5pos WURTH ELEKTRONIK         61300511121            Board-To-Board Connector, Vertical, WR-PHD Series, Through Hole, Header, 5 Contacts, 2.54 mm; Manufacturer: Wurth Electronics; Number of Positions: 5; Gender: Male; Connector Type: Male Pin; Pitch: 0.1inch; Supplier 1: Digi-Key; Manufacturer Part Number: 61300511121; Stock 1: 20896; Pricing 1: 1=0.25, 10=0.209, 25=0.174, 50=0.145, 100=0.132, 1000=0.12 (USD); Mount: Through Hole; Contact Plating: Gold; Contact Material: Copper; Color: Black; Number of Rows: 1; Packaging: Bulk; Termination: Solder; Number of Contacts: 5; Contact Mating Length: 0.236inch; REACH SVHC: Unknown; Lead Free: Lead Free; Supplier Part Number 1: 732-5318-ND
J4 = 87898-0306: CONN_3PIN_SMD HDR 3 POS 2.54mm Solder ST SMD SL™ Frame; Manufacturer: Molex; Number of Positions: 3; Gender: Male; Current Rating: 3A; Voltage Rating: 250V; Glow Wire Compliant: Non-compliant; Supplier 1: Digi-Key; Manufacturer Part Number: 87898-0306; Stock 1: 8330; Pricing 1: 1=0.54, 10=0.502, 100=0.3846, 500=0.3344, 1000=0.27588, 5000=0.24244, 10000=0.22572 (USD); Mount: Surface Mount; Contact Plating: Tin; Contact Material: Copper Alloy; Housing Material: Nylon; Material: Copper Alloy; Min Operating Temperature: -55°C; Max Operating Temperature: 105°C; Number of Rows: 1; Packaging: Tray; Package Quantity: 7200; Number of Contacts: 3; Termination: Solder; Orientation: Straight; Number of Circuits: 3; Pitch: 2.54mm; REACH SVHC: No SVHC; Halogen Free: Low Halogen; ELV: Compliant; Flammability Rating: UL94 V-0; ComponentLink1URL: http://www.mouser.com/ds/2/276/0878980306_PCB_HEADERS-176716.pdf?src-supplier=Mouser; ComponentLink1Description: http://www.mouser.com/ds/2/276/0878980306_PCB_HEADERS-176716.pdf?src-supplier=Mouser; Supplier Part Number 1: WM9810-ND
Q1 Q3 Q5 Q6 Q8 Q9 Q11 Q12 = TSM500P02CXRFG: as Q13 on sheet LED_POWER; Supplier 1: Digi-Key; Manufacturer Part Number: TSM500P02CXRFG; Stock 1: 9267; Pricing 1: 1=0.39, 10=0.309, 100=0.2123, 500=0.1456, 1000=0.1092 (USD); Mount: Surface Mount; Case/Package: SOT-23; Packaging: Tape and Reel; Drain to Source Voltage (Vdss): 20V; Continuous Drain Current (ID): 4.7A; Max Power Dissipation: 1.56W; Supplier Part Number 1: TSM500P02CXRFGCT-ND
Q2 Q4 Q7 Q10 = BSS138: MOSFET N-CH 50V 0.22A 3-Pin SOT-23 T/R; Manufacturer: ON Semiconductor / Fairchild; Rds On Max: 3.5R; Input Capacitance: 27pF; Nominal Vgs: 1.3V; Number of Elements: 1; Max Power Dissipation: 360mW; Rise Time: 9ns; Continuous Drain Current (ID): 220mA; Turn-Off Delay Time: 20ns; Turn-On Delay Time: 2.5ns; Element Configuration: Single; Gate to Source Voltage (Vgs): 20V; On-State Resistance: 6R; Supplier 1: Digi-Key; Manufacturer Part Number: BSS138; Stock 1: 814515; Pricing 1: 1=0.26, 10=0.214, 25=0.1792, 100=0.0876, 500=0.07304, 1000=0.05075 (USD); Mount: Surface Mount; Case/Package: SOT-23; Number of Pins: 3; Weight: 0.03g; Contact Plating: Tin,Matte; Min Operating Temperature: -55°C; Max Operating Temperature: 150°C; Packaging: Tape and Reel; Package Quantity: 1; Dual Supply Voltage: 50V; Drain to Source Voltage (Vdss): 50V; Drain to Source Breakdown Voltage: 50V; Fall Time: 9ns; Drain to Source Resistance: 3.5R; Power Dissipation: 360mW; Threshold Voltage: 1.3V; Termination: SMD/SMT; Voltage Rating (DC): 50V; Current Rating: 220mA; Length: 2.92mm; Height: 0.93mm; Width: 1.3mm; Radiation Hardening: No; REACH SVHC: No SVHC; Lead Free: Lead Free; ComponentLink1URL: https://www.fairchildsemi.com/package-drawings/MA/MA03B.pdf?src-supplier=Digi-Key; ComponentLink1Description: https://www.fairchildsemi.com/package-drawings/MA/MA03B.pdf?src-supplier=Digi-Key; ComponentLink2URL: http://www.farnell.com/datasheets/2304519.pdf?src-supplier=Element14; ComponentLink2Description: http://www.farnell.com/datasheets/2304519.pdf?src-supplier=Element14; ComponentLink3URL: http://www.farnell.com/datasheets/2304519.pdf?src-supplier=Newark; ComponentLink3Description: http://www.farnell.com/datasheets/2304519.pdf?src-supplier=Newark; ComponentLink4URL: https://www.fairchildsemi.com/datasheets/BS/BSS138.pdf?src-supplier=Avnet; ComponentLink4Description: https://www.fairchildsemi.com/datasheets/BS/BSS138.pdf?src-supplier=Avnet; ComponentLink5URL: http://www.fairchildsemi.com/ds/BS/BSS138.pdf?src-supplier=Future+Electronics; ComponentLink5Description: http://www.fairchildsemi.com/ds/BS/BSS138.pdf?src-supplier=Future+Electronics; ComponentLink6URL: http://www.jameco.com/Jameco/Products/ProdDS/784896.pdf?src-supplier=Jameco; ComponentLink6Description: http://www.jameco.com/Jameco/Products/ProdDS/784896.pdf?src-supplier=Jameco; ComponentLink7URL: http://www.fairchildsemi.com/ds/BS/BSS138.pdf?src-supplier=Avnet+Europe; ComponentLink7Description: http://www.fairchildsemi.com/ds/BS/BSS138.pdf?src-supplier=Avnet+Europe; Supplier Part Number 1: BSS138CT-ND
R1 R2 = CRG0402F4K7: RES SMD 4.7K 0402 4.7K Ohm 1% 1/16W ±100ppm/°C Molded SMD SMD; Manufacturer: TE Connectivity; Supplier 1: Newark; Manufacturer Part Number: CRG0402F4K7; Stock 1: 0; Pricing 1: 10000=0.006, 20000=0.003, 200000=0.003, 400000=0.003, 1000000=0.003, 1=0.004, 20000=0.002, 200000=0.002, 400000=0.002, 1000000=0.002 (CAD); Supplier Part Number 1: 30AC5442
R3-R11 = RC0402JR-0710KL: as R20 on sheet LED_POWER; Supplier 1: Digi-Key; Manufacturer Part Number: RC0402JR-0710KL; Stock 1: 47303622; Pricing 1: 1=0.1, 10=0.018, 100=0.0073, 1000=0.0033, 2500=0.0029, 5000=0.0024 (USD); Case/Package: 0402; Case Code (Metric): 1005; Case Code (Imperial): 0402; Min Operating Temperature: -55°C; Max Operating Temperature: 155°C; Packaging: Tape and Reel; Tolerance: 5%; Package Quantity: 1; Composition: Thick Film; Number of Terminations: 2; Termination: SMD/SMT; Military Standard: Not; Features: Moisture Resistant; Length: 1mm; Height: 0.016inch; Width: 0.02inch; Depth: 0.5mm; REACH SVHC: Unknown; Lead Free: Lead Free; Supplier Part Number 1: 311-10KJRCT-ND
R12 = RMCF0402FT100K: as R16 on sheet LED_POWER; Supplier 1: Digi-Key; Manufacturer Part Number: RMCF0402FT100K; Stock 1: 796221; Pricing 1: 1=0.1, 10=0.015, 100=0.0061, 1000=0.0028, 2500=0.0024, 5000=0.002 (USD); Mount: Surface Mount; Case/Package: 0402; Case Code (Metric): 1005; Case Code (Imperial): 0402; Contact Plating: Tin,Matte; Min Operating Temperature: -55°C; Max Operating Temperature: 155°C; Packaging: Tape and Reel; Composition: Thick Film; Number of Terminations: 2; Military Standard: Not; Features: Automotive AEC-Q200; Length: 1mm; Height: 0.016inch; Width: 0.02inch; Depth: 0.5mm; Radiation Hardening: No; Lead Free: Lead Free; ComponentLink1URL: https://www.verical.com/server-webapp/html/getDatasheet?partID=482656&src-supplier=Verical; ComponentLink1Description: https://www.verical.com/server-webapp/html/getDatasheet?partID=482656&src-supplier=Verical; Supplier Part Number 1: RMCF0402FT100KCT-ND
R13 = CRCW04023K30FKEDC: RES SMD 3.3K OHM 1% 1/16W 0402; Manufacturer: Vishay; Resistance: 3.3kR; Max Power Dissipation: 63mW; Temperature Coefficient: 100ppm/°C; Supplier 1: Digi-Key; Manufacturer Part Number: CRCW04023K30FKEDC; Stock 1: 19004; Pricing 1: 1=0.1, 10=0.032, 100=0.013, 1000=0.00583, 2500=0.00506, 5000=0.00418 (USD); Case/Package: 0402; Case Code (Imperial): 0402; Case Code (Metric): 1005; Min Operating Temperature: -55°C; Max Operating Temperature: 155°C; Composition: Thick Film; Packaging: Cut Tape; Tolerance: 1%; Number of Terminations: 2; ComponentLink1URL: http://www.vishay.com/docs/28773/crcwce3.pdf?src-supplier=Digi-Key; ComponentLink1Description: http://www.vishay.com/docs/28773/crcwce3.pdf?src-supplier=Digi-Key; Supplier Part Number 1: 541-4080-6-ND
U1 = STM32F070F6P6TR: IC MCU 32BIT 32KB FLASH 20TSSOP; Manufacturer: STMicroelectronics; Interface: I2C,SPI,USB,UART,USART; Peripherals: POR,PWM,WDT,DMA; Core Architecture: ARM; Frequency: 48MHz; Number of I/Os: 15; Oscillator Type: Internal; Supplier 1: Digi-Key; Manufacturer Part Number: STM32F070F6P6TR; Stock 1: 6559; Pricing 1: 1=1.48, 10=1.324, 25=1.2568, 100=1.0322, 250=0.96492, 500=0.85272, 1000=0.6732 (USD); Case/Package: TSSOP; Number of Pins: 20; Min Operating Temperature: -40°C; Max Operating Temperature: 85°C; Memory Type: FLASH; Packaging: Tape and Reel; Memory Size: 32KB; ComponentLink1URL: http://www.farnell.com/datasheets/2281751.pdf?src-supplier=Newark; ComponentLink1Description: http://www.farnell.com/datasheets/2281751.pdf?src-supplier=Newark; ComponentLink2URL: http://www.st.com/content/ccc/resource/technical/document/datasheet/31/4f/10/5f/a5/32/46/42/DM00141386.pdf/files/DM00141386.pdf/jcr:content/translations/en.DM00141386.pdf?src-supplier=Digi-Key; ComponentLink2Description: http://www.st.com/content/ccc/resource/technical/document/datasheet/31/4f/10/5f/a5/32/46/42/DM00141386.pdf/files/DM00141386.pdf/jcr:content/translations/en.DM00141386.pdf?src-supplier=Digi-Key; ComponentLink3URL: http://www.farnell.com/datasheets/2281751.pdf?src-supplier=Farnell; ComponentLink3Description: http://www.farnell.com/datasheets/2281751.pdf?src-supplier=Farnell; Supplier Part Number 1: 497-17354-6-ND
U2 = SN74HC595DR: IC SHIFT REGISTER      SN74HC595DR             Shift Register, HC Family, Serial to Parallel, 1 Element, SOIC, 16 Pins, 2 V, 6 V; Manufacturer: Texas Instruments; Direction: Unidirectional; Max Supply Voltage: 6V; Min Supply Voltage: 2V; Propagation Delay: 250ns; Number of Elements: 1; Operating Supply Voltage: 5V; Frequency: 42MHz; Number of Circuits: 4; Number of Bits: 8; Number of Output Lines: 10; Max Input Current: 1uA; Quiescent Current: 8uA; Supplier 1: Digi-Key; Manufacturer Part Number: SN74HC595DR; Stock 1: 26701; Pricing 1: 1=0.39, 10=0.338, 25=0.3152, 100=0.252, 250=0.234, 500=0.198, 1000=0.153 (USD); Mount: Surface Mount; Case/Package: SOIC; Number of Pins: 16; Weight: 0.004998oz; Contact Plating: Gold; Min Operating Temperature: -40°C; Max Operating Temperature: 85°C; Packaging: Tape and Reel; Package Quantity: 2500; Logic Function: Shift Register; Number of Bits per Element: 8; Turn-On Delay Time: 250ns; Termination: SMD/SMT; Length: 9.9mm; Height: 1.58mm; Width: 3.91mm; Radiation Hardening: No; REACH SVHC: No SVHC; Lead Free: Lead Free; ComponentLink1URL: http://www.ti.com/lit/ds/symlink/sn74hc595.pdf?src-supplier=Digi-Key; ComponentLink1Description: http://www.ti.com/lit/ds/symlink/sn74hc595.pdf?src-supplier=Digi-Key; ComponentLink2URL: http://www.farnell.com/datasheets/1831198.pdf?src-supplier=Element14; ComponentLink2Description: http://www.farnell.com/datasheets/1831198.pdf?src-supplier=Element14; ComponentLink3URL: http://www.farnell.com/datasheets/1886142.pdf?src-supplier=Element14; ComponentLink3Description: http://www.farnell.com/datasheets/1886142.pdf?src-supplier=Element14; ComponentLink4URL: https://www.verical.com/server-webapp/html/getDatasheet?partID=134875&src-supplier=Verical; ComponentLink4Description: https://www.verical.com/server-webapp/html/getDatasheet?partID=134875&src-supplier=Verical; ComponentLink5URL: http://www.farnell.com/datasheets/1905810.pdf?src-supplier=Element14; ComponentLink5Description: http://www.farnell.com/datasheets/1905810.pdf?src-supplier=Element14; ComponentLink6URL: http://www.ti.com/general/docs/lit/getliterature.tsp?genericPartNumber=SN54HC595-SP&&fileType=pdf&src-supplier=Avnet; ComponentLink6Description: http://www.ti.com/general/docs/lit/getliterature.tsp?genericPartNumber=SN54HC595-SP&&fileType=pdf&src-supplier=Avnet; ComponentLink7URL: http://www.jameco.com/Jameco/Products/ProdDS/916385.pdf?src-supplier=Jameco; ComponentLink7Description: http://www.jameco.com/Jameco/Products/ProdDS/916385.pdf?src-supplier=Jameco; ComponentLink8URL: http://www.farnell.com/datasheets/2020588.pdf?src-supplier=Element14; ComponentLink8Description: http://www.farnell.com/datasheets/2020588.pdf?src-supplier=Element14; ComponentLink9URL: http://datasheet.iiic.cc/texas_instruments/SN74HC595DR.pdf?src-supplier=IIIC; ComponentLink9Description: http://datasheet.iiic.cc/texas_instruments/SN74HC595DR.pdf?src-supplier=IIIC; Supplier Part Number 1: 296-14857-6-ND
U3 = IS31FL3236A-QFLS2-TR: IC LED DRVR LINEAR 36CH 44QFN; Manufacturer: ISSI; Dimming: I²C; Number of Outputs: 36; Max Supply Voltage: 5.5V; Output Current per Channel: 38mA; Supplier 1: Digi-Key; Manufacturer Part Number: IS31FL3236A-QFLS2-TR; Stock 1: 6257; Pricing 1: 1=1.65, 10=1.484, 25=1.4, 100=1.12, 250=0.98, 500=0.952, 1000=0.756 (USD); Mount: Surface Mount; Case/Package: QFN; Number of Pins: 44; Min Operating Temperature: -40°C; Max Operating Temperature: 85°C; Packaging: Tape and Reel; ComponentLink1URL: http://www.issi.com/WW/pdf/31FL3236A.pdf?src-supplier=Digi-Key; ComponentLink1Description: http://www.issi.com/WW/pdf/31FL3236A.pdf?src-supplier=Digi-Key; Supplier Part Number 1: 706-1589-1-ND